# EasyEDA Pro project examples.epro, schematic Schematic1
Create Date: 2026-03-05; Page Name: P1; Project Name: EdaCopilotExamples; Schematic Name: Schematic1; Update Date: 2026-03-05; Company: EasyEDA.com; Page Size: A4; Version: V1.0
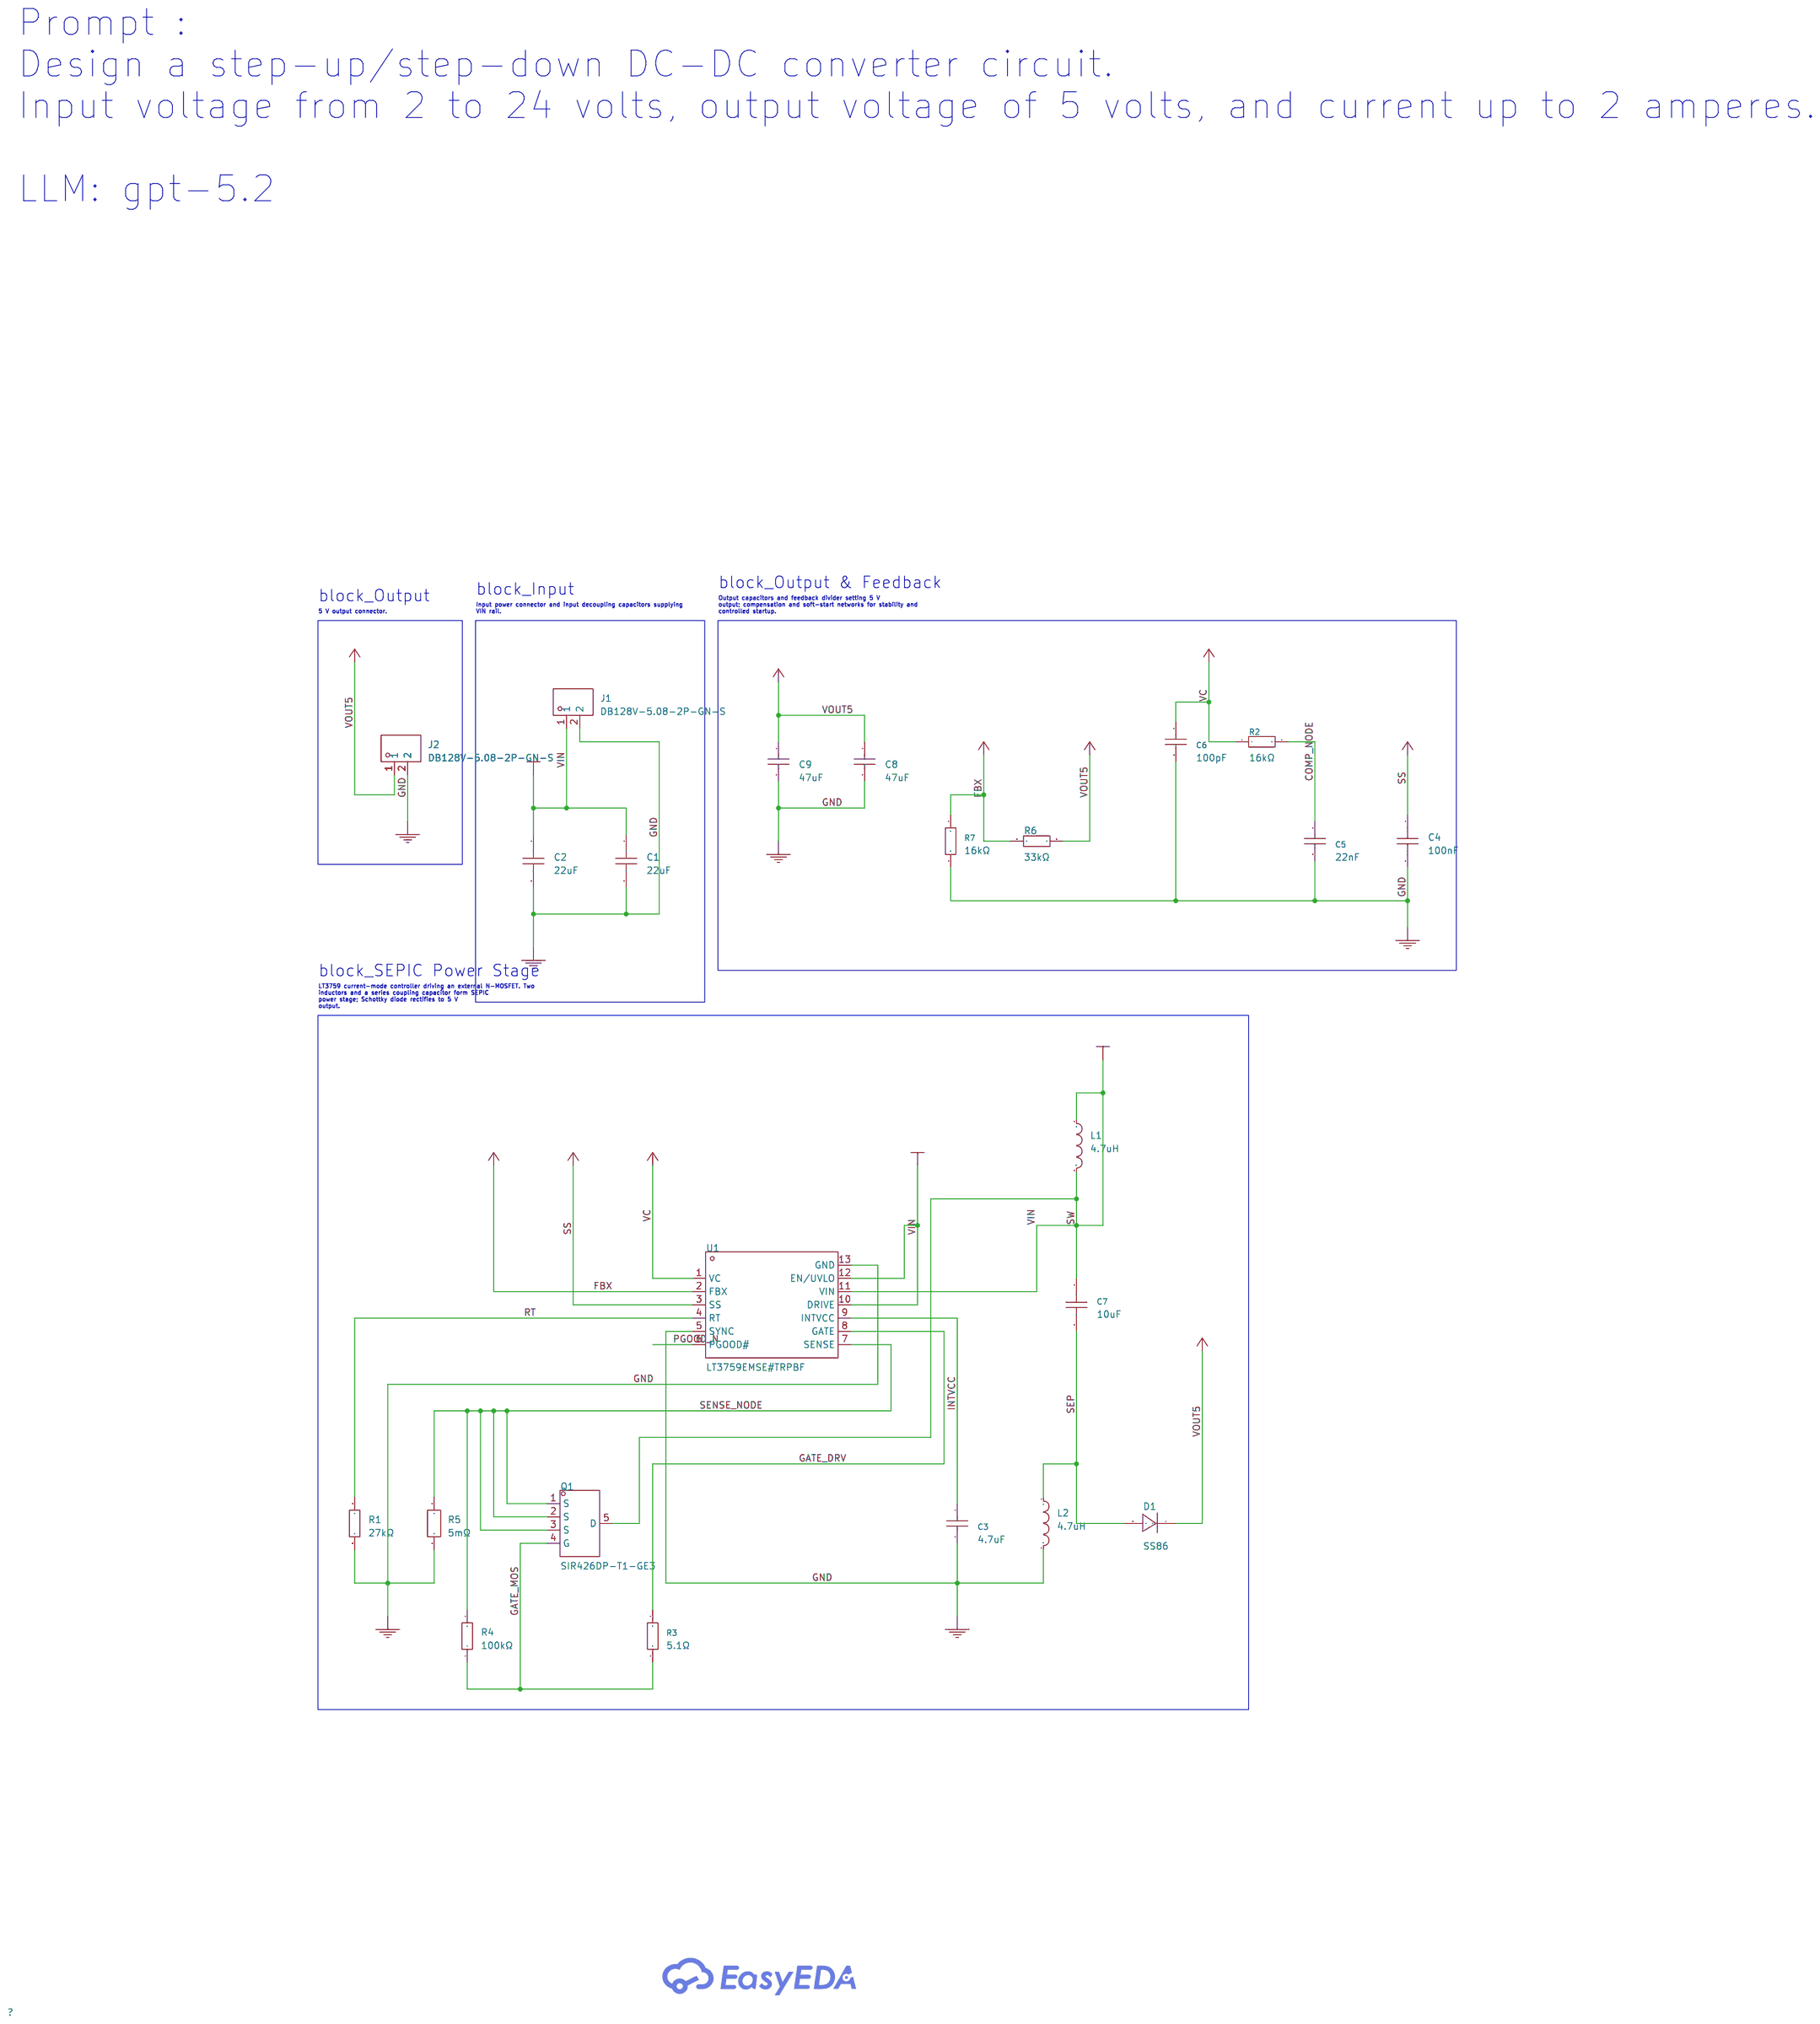
[diagram p0: schematic sheet]

## Parts
C1  22uF  [C0603]
C2  22uF  [C0603]
C3  4.7uF  [C0603]
C4  100nF  [C0402]
C5  22nF  [C0603]
C6  100pF  [C0402]
C7  10uF  [C0603]
C8  47uF  [C1206]
C9  47uF  [C1206]
D1  SS86  [SMC_L6.9-W5.9-LS7.9-RD]
J1  DB128V-5.08-2P-GN-S  [CONN-TH_2P-P5.08_DIBO_DB128V-5.08]
J2  DB128V-5.08-2P-GN-S  [CONN-TH_2P-P5.08_DIBO_DB128V-5.08]
L1  4.7uH  [IND-SMD_L4.0-W4.0]
L2  4.7uH  [IND-SMD_L4.0-W4.0]
Q1  SIR426DP-T1-GE3  [POWERVDFN-8_L6.2-W5.2-P1.27-LS6.0-BL]
R1  27kΩ  [R0402]
R2  16kΩ  [R0603]
R3  5.1Ω  [R1206]
R4  100kΩ  [R0402]
R5  5mΩ  [R1206]
R6  33kΩ  [R0402]
R7  16kΩ  [R0603]
U1  LT3759EMSE#TRPBF  [MSOP-12_L4.0-W3.0-P0.65-LS4.9-BL-EP]

## Library data of the parts
C1 C2 = CL10A226MQ8NRNC: Capacitance:22uF Tolerance:±20% Tolerance:±20% Voltage Rating:6.3V Temperature Coefficient:X5R; LCSC Part Name: 22uF ±20% 6.3V; Supplier Part: C59461; Manufacturer: SAMSUNG(三星); Supplier Footprint: 0603; JLCPCB Part Class: Basic Part; Datasheet: https://item.szlcsc.com/datasheet/CL10A226MQ8NRNC/60514.html; Supplier: LCSC; Tolerance: ±20%; Voltage Rating: 6.3V; Temperature Coefficient: X5R; supplier: LCSC; supplierId: C59461
C3 = CL10A475KP8NNNC: Capacitance:4.7uF Tolerance:±10% Tolerance:±10% Voltage Rating:10V Temperature Coefficient:X5R; LCSC Part Name: 4.7uF ±10% 10V; Supplier Part: C1705; Manufacturer: SAMSUNG(三星); Supplier Footprint: 0603; JLCPCB Part Class: Extended Part; Datasheet: https://item.szlcsc.com/datasheet/CL10A475KP8NNNC/2057.html; Supplier: LCSC; Tolerance: ±10%; Voltage Rating: 10V; Temperature Coefficient: X5R; supplier: LCSC; supplierId: C1705
C4 = CL05B104KB54PNC: Capacitance:100nF Tolerance:±10% Tolerance:±10% Voltage Rating:50V Temperature Coefficient:X7R; LCSC Part Name: 100nF ±10% 50V; Supplier Part: C307331; Manufacturer: SAMSUNG(三星); Supplier Footprint: 0402; JLCPCB Part Class: Basic Part; Datasheet: https://item.szlcsc.com/datasheet/CL05B104KB54PNC/291005.html; Supplier: LCSC; Tolerance: ±10%; Voltage Rating: 50V; Temperature Coefficient: X7R; supplier: LCSC; supplierId: C307331
C5 = CL10B223KB8NNNC: Capacitance:22nF Tolerance:±10% Tolerance:±10% Voltage Rating:50V Temperature Coefficient:X7R; LCSC Part Name: 22nF ±10% 50V; Supplier Part: C21122; Manufacturer: SAMSUNG(三星); Supplier Footprint: 0603; JLCPCB Part Class: Basic Part; Datasheet: https://item.szlcsc.com/datasheet/CL10B223KB8NNNC/21834.html; Supplier: LCSC; Tolerance: ±10%; Voltage Rating: 50V; Temperature Coefficient: X7R; supplier: LCSC; supplierId: C21122
C6 = CC0402JRNPO9BN101: Capacitance:100pF Tolerance:±5% Tolerance:±5% Voltage Rating:50V Temperature Coefficient:NP0; LCSC Part Name: 100pF ±5% 50V; Supplier Part: C106200; Manufacturer: YAGEO(国巨); Supplier Footprint: 0402; JLCPCB Part Class: Extended Part; Datasheet: https://item.szlcsc.com/datasheet/CC0402JRNPO9BN101/107415.html; Supplier: LCSC; Tolerance: ±5%; Voltage Rating: 50V; Temperature Coefficient: NP0; supplier: LCSC; supplierId: C106200
C7 = CL10A106MA8NRNC: Capacitance:10uF Tolerance:±20% Tolerance:±20% Voltage Rating:25V Temperature Coefficient:X5R; LCSC Part Name: 10uF ±20% 25V; Supplier Part: C96446; Manufacturer: SAMSUNG(三星); Supplier Footprint: 0603; JLCPCB Part Class: Basic Part; Datasheet: https://item.szlcsc.com/datasheet/CL10A106MA8NRNC/97651.html; Supplier: LCSC; Tolerance: ±20%; Voltage Rating: 25V; Temperature Coefficient: X5R; supplier: LCSC; supplierId: C96446
C8 C9 = CL31A476MQHNNNE: Capacitance:47uF Tolerance:±20% Tolerance:±20% Voltage Rating:6.3V Temperature Coefficient:X5R; LCSC Part Name: 47uF ±20% 6.3V; Supplier Part: C68361; Manufacturer: SAMSUNG(三星); Supplier Footprint: 1206; JLCPCB Part Class: Extended Part; Datasheet: https://item.szlcsc.com/datasheet/CL31A476MQHNNNE/69467.html; Supplier: LCSC; Tolerance: ±20%; Voltage Rating: 6.3V; Temperature Coefficient: X5R; supplier: LCSC; supplierId: C68361
D1 = SS86_C2940188: Diode Configuration:Independent Voltage - Forward(Vf@If):750mV@8A Voltage - DC Reverse(Vr):60V Current - Rectified:8A Reverse Leakage Current (Ir):1mA@60V Operating Junction Temperature Range:-50℃~+125℃ Operating Junction Temperature Range:-50℃~+125℃ Non-; LCSC Part Name: 电压:60V 电流:8A; Supplier Part: C2940188; Manufacturer: LGE(鲁光); Supplier Footprint: SMC; JLCPCB Part Class: Extended Part; Datasheet: https://item.szlcsc.com/datasheet/SS86/3303804.html; Supplier: LCSC; Diode Configuration: Independent; Voltage - Forward(Vf@If): 750mV@8A; Voltage - DC Reverse(Vr): 60V; Current - Rectified: 8A; Reverse Leakage Current (Ir): 1mA@60V; Operating Junction Temperature Range: -50℃~+125℃; Non-Repetitive Peak Forward Surge Current: 150A; supplier: LCSC; supplierId: C2940188
J1 J2 = DB128V-5.08-2P-GN-S: Number of Positions or Pins:1x2P Pitch:5.08mm Color:Green Mounting Type:Through Hole Number of Pins:2P Number of Rows:1 Number of PINs Per Row:2 Screw Specification:M2.5 Current Rating:16A Voltage Rating (Max):300V Wire Gauge - AWG:12~22 Wire Gauge - AWG:; LCSC Part Name: 1x2P 5.08mm 直插 排数:1 每排P数:2; Supplier Part: C2915639; Manufacturer: DORABO(地博电气); Supplier Footprint: 插件,P=5.08mm; JLCPCB Part Class: Extended Part; Datasheet: https://item.szlcsc.com/datasheet/DB128V-5.08-2P-GN-S/3209395.html; Supplier: LCSC; Number of Positions or Pins: 1x2P; Pitch: 5.08mm; Color: Green; Mounting Type: Through Hole; Number of Pins: 2P; Number of Rows: 1; Number of PINs Per Row: 2; Screw Specification: M2.5; Current Rating: 16A; Voltage Rating (Max): 300V; Wire Gauge - AWG: 12~22; Wire Gauge - mm2: 2.5; Operating Temperature: -40℃~+105℃; supplier: LCSC; supplierId: C2915639
L1 L2 = FHD4020S-4R7MT: Inductance:4.7uH Tolerance:±20% Tolerance:±20% Current Rating:3.3A Current - Saturation(Isat):4.9A DC Resistance(DCR):95mΩ Type:-; LCSC Part Name: 4.7uH ±20% 4.9A; Supplier Part: C602031; Manufacturer: cjiang(长江微电); Supplier Footprint: SMD,4x4mm; JLCPCB Part Class: Extended Part; Datasheet: https://item.szlcsc.com/datasheet/FHD4020S-4R7MT/631461.html; Supplier: LCSC; Tolerance: ±20%; Current Rating: 3.3A; Current - Saturation(Isat): 4.9A; DC Resistance(DCR): 95mΩ; supplier: LCSC; supplierId: C602031
Q1 = SIR426DP-T1-GE3: Number:1 N-Channel Drain to Source Voltage:40V Current - Continuous Drain(Id):30A RDS(on):10.5mΩ@10V,30A Pd - Power Dissipation:26.7W Gate Threshold Voltage (Vgs(th)):1.2V Gate Charge(Qg):9.3nC@10V Input Capacitance(Ciss):1.16nF@20V Reverse Transfer Capac; LCSC Part Name: 1个N沟道 耐压:40V 电流:30A; Supplier Part: C52893; Manufacturer: VISHAY(威世); Supplier Footprint: PowerPAK-SO-8; JLCPCB Part Class: Extended Part; Datasheet: https://item.szlcsc.com/datasheet/SIR426DP-T1-GE3/53908.html; Supplier: LCSC; Number: 1 N-Channel; Drain to Source Voltage: 40V; Current - Continuous Drain(Id): 30A; RDS(on): 10.5mΩ@10V,30A; Pd - Power Dissipation: 26.7W; Gate Threshold Voltage (Vgs(th)): 1.2V; Gate Charge(Qg): 9.3nC@10V; Input Capacitance(Ciss): 1.16nF@20V; Reverse Transfer Capacitance (Crss@Vds): 70pF@20V; Operating Temperature: -55℃~+150℃; supplier: LCSC; supplierId: C52893
R1 = RC0402FR-0727KL: Type:Thick Film Resistor Resistance:27kΩ Tolerance:±1% Tolerance:±1% Power(Watts):62.5mW Voltage-Supply(Max):50V Temperature Coefficient:±100ppm/℃ Temperature Coefficient:±100ppm/℃ Operating Temperature:-55℃~+155℃ Operating Temperature:-55℃~+155℃; LCSC Part Name: 厚膜电阻 27kΩ ±1% 62.5mW; Supplier Part: C138022; Manufacturer: YAGEO(国巨); Supplier Footprint: 0402; JLCPCB Part Class: Extended Part; Datasheet: https://item.szlcsc.com/datasheet/RC0402FR-0727KL/149338.html; Supplier: LCSC; Type: Thick Film Resistor; Tolerance: ±1%; Power(Watts): 62.5mW; Voltage-Supply(Max): 50V; Temperature Coefficient: ±100ppm/℃; Operating Temperature: -55℃~+155℃; supplier: LCSC; supplierId: C138022
R2 R7 = 0603WAF1602T5E: Type:Thick Film Resistor Resistance:16kΩ Tolerance:±1% Tolerance:±1% Power(Watts):100mW Voltage-Supply(Max):75V Temperature Coefficient:±100ppm/℃ Temperature Coefficient:±100ppm/℃ Operating Temperature:-55℃~+155℃ Operating Temperature:-55℃~+155℃; LCSC Part Name: 16kΩ ±1% 100mW 厚膜电阻; Supplier Part: C4210; Manufacturer: UNI-ROYAL(厚声); Supplier Footprint: 0603; JLCPCB Part Class: Extended Part; Datasheet: https://item.szlcsc.com/datasheet/0603WAF1602T5E/4617.html; Supplier: LCSC; Type: Thick Film Resistor; Tolerance: ±1%; Power(Watts): 100mW; Voltage-Supply(Max): 75V; Temperature Coefficient: ±100ppm/℃; Operating Temperature: -55℃~+155℃; supplier: LCSC; supplierId: C4210
R3 = 1206W4J051JT5E_C37912: Type:Thick Film Resistor Resistance:5.1Ω Tolerance:±5% Tolerance:±5% Power(Watts):250mW Voltage-Supply(Max):200V Temperature Coefficient:±400ppm/℃ Temperature Coefficient:±400ppm/℃ Operating Temperature:-55℃~+155℃ Operating Temperature:-55℃~+155℃; LCSC Part Name: 5.1Ω ±5% 250mW 厚膜电阻; Supplier Part: C37912; Manufacturer: UNI-ROYAL(厚声); Manufacturer Part: 1206W4J051JT5E; Supplier Footprint: 1206; JLCPCB Part Class: Extended Part; Datasheet: https://item.szlcsc.com/datasheet/1206W4J051JT5E/38892.html; Supplier: LCSC; Type: Thick Film Resistor; Tolerance: ±5%; Power(Watts): 250mW; Voltage-Supply(Max): 200V; Temperature Coefficient: ±400ppm/℃; Operating Temperature: -55℃~+155℃; supplier: LCSC; supplierId: C37912
R4 = RC0402FR-07100KL: Type:Thick Film Resistor Resistance:100kΩ Tolerance:±1% Tolerance:±1% Power(Watts):62.5mW Voltage-Supply(Max):50V Temperature Coefficient:±100ppm/℃ Temperature Coefficient:±100ppm/℃ Operating Temperature:-55℃~+155℃ Operating Temperature:-55℃~+155℃; LCSC Part Name: 厚膜电阻 100kΩ ±1% 62.5mW; Supplier Part: C60491; Manufacturer: YAGEO(国巨); Supplier Footprint: 0402; JLCPCB Part Class: Extended Part; Datasheet: https://item.szlcsc.com/datasheet/RC0402FR-07100KL/61543.html; Supplier: LCSC; Type: Thick Film Resistor; Tolerance: ±1%; Power(Watts): 62.5mW; Voltage-Supply(Max): 50V; Temperature Coefficient: ±100ppm/℃; Operating Temperature: -55℃~+155℃; supplier: LCSC; supplierId: C60491
R5 = FRM121WFR005TM: Type:Current Sense Resistor Resistance:5mΩ Tolerance:±1% Tolerance:±1% Power(Watts):1W Temperature Coefficient:±50ppm/℃ Temperature Coefficient:±50ppm/℃; LCSC Part Name: 5mΩ ±1% 1W 合金电阻; Supplier Part: C7419996; Manufacturer: FOJAN(富捷); Supplier Footprint: 1206; JLCPCB Part Class: Extended Part; Datasheet: https://item.szlcsc.com/datasheet/FRM121WFR005TM/8395289.html; Supplier: LCSC; Type: Current Sense Resistor; Tolerance: ±1%; Power(Watts): 1W; Temperature Coefficient: ±50ppm/℃; supplier: LCSC; supplierId: C7419996
R6 = RC0402FR-0733KL: Type:Thick Film Resistor Resistance:33kΩ Tolerance:±1% Tolerance:±1% Power(Watts):62.5mW Voltage-Supply(Max):50V Temperature Coefficient:±100ppm/℃ Temperature Coefficient:±100ppm/℃ Operating Temperature:-55℃~+155℃ Operating Temperature:-55℃~+155℃; LCSC Part Name: 厚膜电阻 33kΩ ±1% 62.5mW; Supplier Part: C138003; Manufacturer: YAGEO(国巨); Supplier Footprint: 0402; JLCPCB Part Class: Extended Part; Datasheet: https://item.szlcsc.com/datasheet/RC0402FR-0733KL/149319.html; Supplier: LCSC; Type: Thick Film Resistor; Tolerance: ±1%; Power(Watts): 62.5mW; Voltage-Supply(Max): 50V; Temperature Coefficient: ±100ppm/℃; Operating Temperature: -55℃~+155℃; supplier: LCSC; supplierId: C138003
U1 = LT3759EMSE#TRPBF: Function:Boost；Buck-Boost Output Type:Adjustable Voltage - Supply:1.6V~42V Voltage - Supply:1.6V~42V Output Voltage:- Output Voltage:- Output Current:- Frequency - Switching:100kHz~1MHz Frequency - Switching:100kHz~1MHz Operating Temperature:-40℃~+125℃@(T; LCSC Part Name: 宽输入电压范围升压 / SEPIC / 负输出控制器; Supplier Part: C580139; Manufacturer: ADI(亚德诺); Supplier Footprint: MSOP-12-EP-0.65mm; JLCPCB Part Class: Extended Part; Datasheet: https://item.szlcsc.com/datasheet/LT3759EMSE%2523TRPBF/607916.html; Supplier: LCSC; Function: Boost；Buck-Boost; Output Type: Adjustable; Voltage - Supply: 1.6V~42V; Frequency - Switching: 100kHz~1MHz; Operating Temperature: -40℃~+125℃@(TJ); Synchronous Rectifier: No; Number of Outputs: 1; Topology: Inverting；Boost；SEPIC; Quiescent Current: 350uA; Switch tube (built-in/external): External; supplier: LCSC; supplierId: C580139

## Nets
GND: C1.2 C2.2 C3.2 C4.2 C5.2 C6.2 C8.2 C9.2 J1.2 J2.2 L2.2 R1.2 R5.2 R7.2 U1.5(SYNC) U1.13(GND)
VIN: C1.1 C2.1 J1.1 L1.1 U1.10(DRIVE) U1.11(VIN) U1.12(EN/UVLO)
COMP_NODE: C5.1 R2.2
FBX: R6.2 R7.1 U1.2(FBX)
GATE_DRV: R3.1 U1.8(GATE)
GATE_MOS: Q1.4(G) R3.2 R4.1
INTVCC: C3.1 U1.9(INTVCC)
PGOOD_N: U1.6(PGOOD#)
RT: R1.1 U1.4(RT)
SENSE_NODE: Q1.1(S) Q1.2(S) Q1.3(S) R4.2 R5.1 U1.7(SENSE)
SEP: C7.2 D1.2(A) L2.1
SS: C4.1 U1.3(SS)
SW: C7.1 L1.2 Q1.5(D)
VC: C6.1 R2.1 U1.1(VC)
VOUT5: C8.1 C9.1 D1.1(K) J2.1 R6.1

## Notes on the sheet
- Prompt :
  Design a step-up/step-down DC-DC converter circuit.
  Input voltage from 2 to 24 volts, output voltage of 5 volts, and current up to 2 amperes.
  LLM: gpt-5.2
- block_Output & Feedback
- block_Output
- block_Input
- Input power connector and input decoupling capacitors supplying
  VIN rail.
- Output capacitors and feedback divider setting 5 V
  output; compensation and soft-start networks for stability and
  controlled startup.
- 5 V output connector.
- block_SEPIC Power Stage
- LT3759 current-mode controller driving an external N-MOSFET. Two
  inductors and a series coupling capacitor form SEPIC
  power stage; Schottky diode rectifies to 5 V
  output.
